# EAGLE design Lumazoid_v1.0 (EAGLE 6.4)
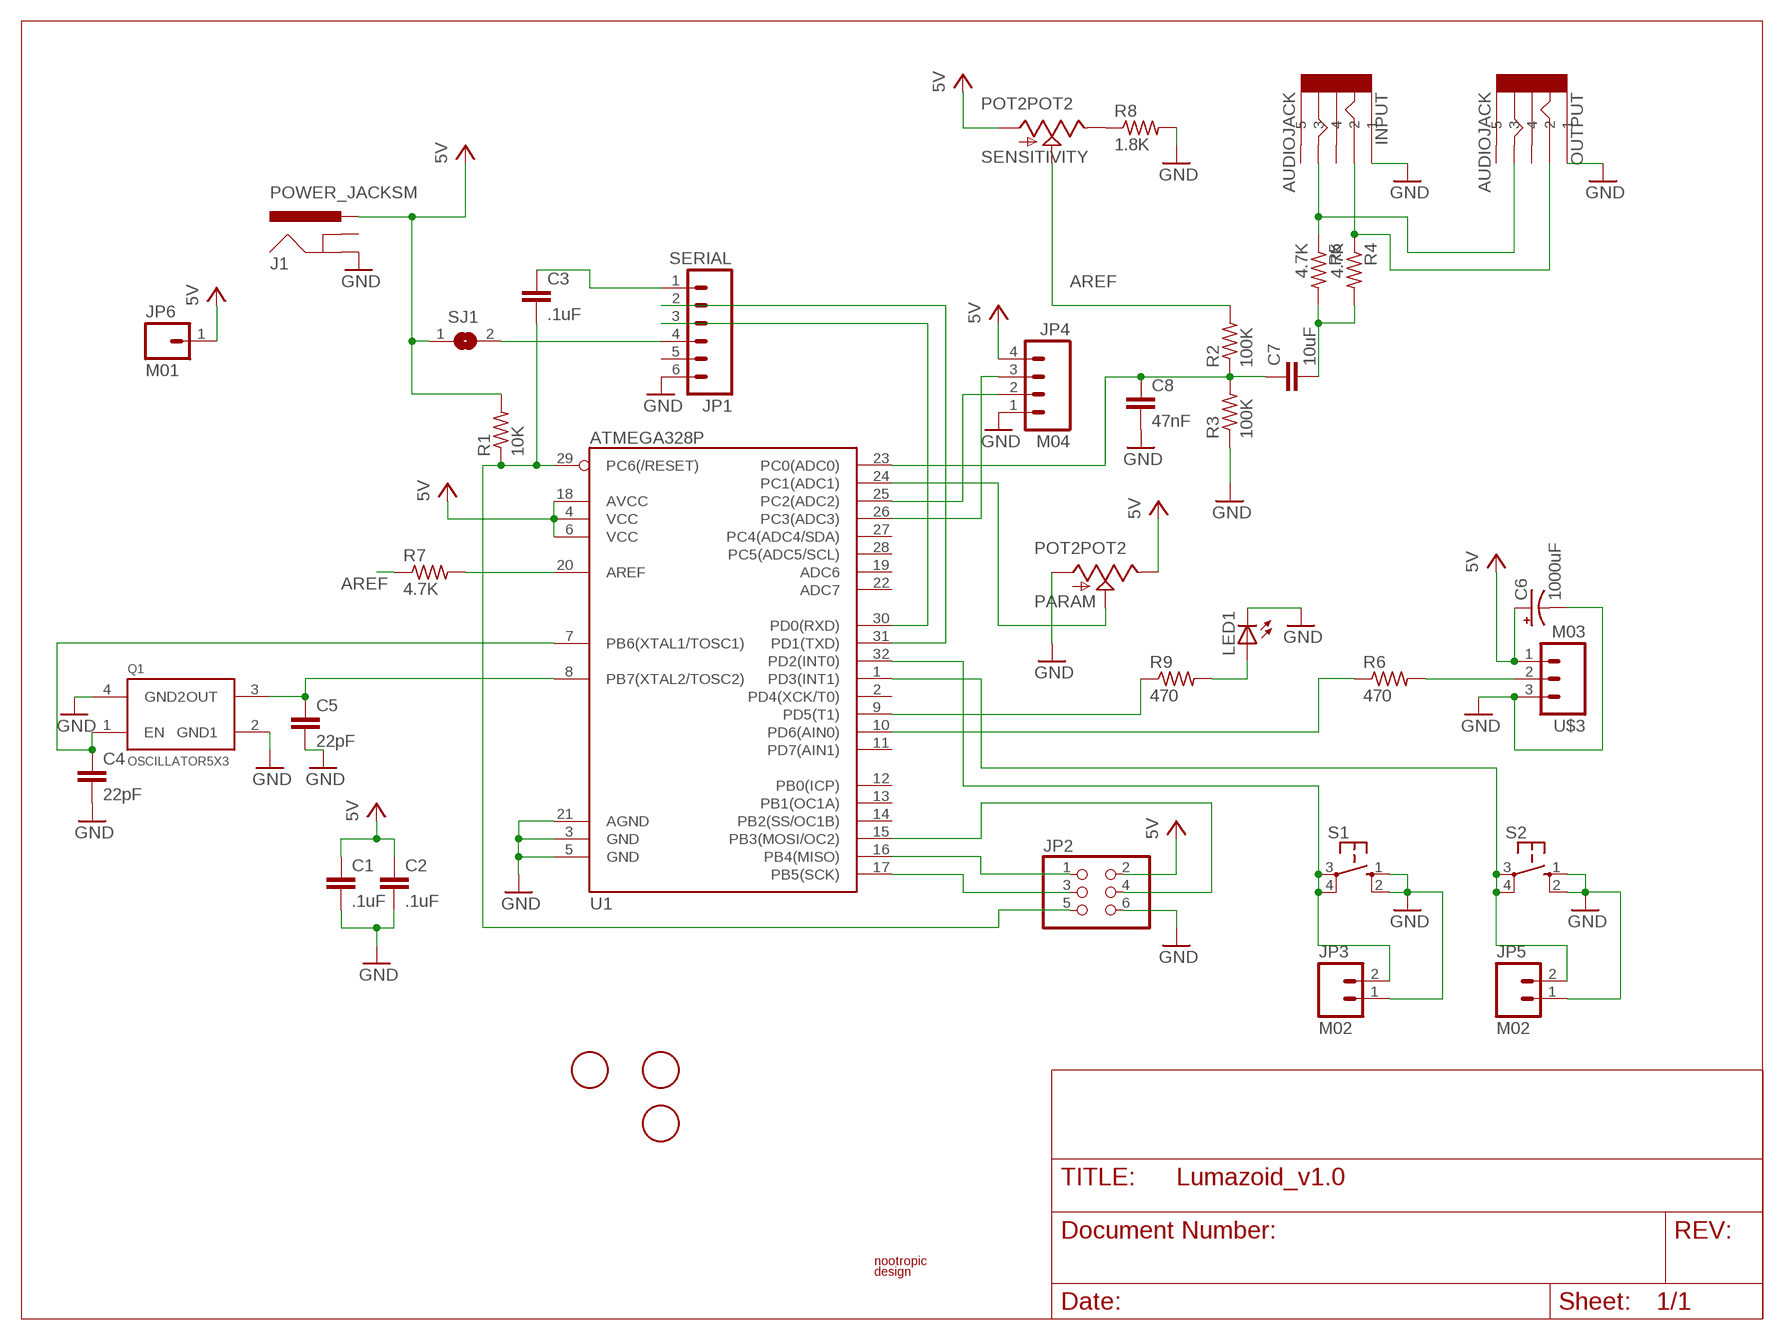
[diagram p0: schematic, sheet 1]

## Parts
C1  .1uF  CAPC0603  [C0603]
C2  .1uF  CAPC0603  [C0603]
C3  .1uF  CAPC0603  [C0603]
C4  22pF  CAPC0603  [C0603]
C5  22pF  CAPC0603  [C0603]
C6  1000uF  CPOL-USE5-10.5  [E5-10,5]
C7  10uF  CAPC1206  [C1206]
C8  47nF  CAPC0603  [C0603]
FID1  FIDUCIAL  [FIDUCIAL_1MM]
FID2  FIDUCIAL  [FIDUCIAL_1MM]
FID3  FIDUCIAL  [FIDUCIAL_1MM]
INPUT  AUDIOJACK  [AUDIOJACK]
J1  POWER_JACKSM  [POWER_JACK_SM]
JP1  SERIAL  M06  [1X06]
JP2  PINHD-2X3  [2X03]
JP3  M02  [1X02]
JP4  M04  [1X04]
JP5  M02  [1X02]
JP6  M01  [1X01]
LED1  LEDCHIPLED_0805  [CHIPLED_0805]
OUTPUT  AUDIOJACK  [AUDIOJACK]
PARAM  POT2POT2  [ALPS_POT]
Q1  OSCILLATOR5X3  [CRYSTAL-SMD-5X3]
R1  10K  R-USR0603  [R0603]
R2  100K  R-USR0603  [R0603]
R3  100K  R-USR0603  [R0603]
R4  4.7K  R-USR0603  [R0603]
R5  4.7K  R-USR0603  [R0603]
R6  470  R-USR0603  [R0603]
R7  4.7K  R-USR0603  [R0603]
R8  1.8K  R-USR0603  [R0603]
R9  470  R-USR0603  [R0603]
S1  SWITCH-TACT6MMSMT-J  [DTSM-6-JBEND]
S2  SWITCH-TACT6MMSMT-J  [DTSM-6-JBEND]
SENSITIVITY  POT2POT2  [ALPS_POT]
SJ1  SJ  [SJ]
U1  ATMEGA328P  ATMEGA328_SMT  [TQFP32-08]
U$1  LOGO  [LOGO_SMALL]
U$3  M03  [1X03]

## Nets
A0: C7.1 C8.1 R2.1 R3.2 U1.23(PC0(ADC0))
A1: PARAM.P$2 U1.24(PC1(ADC1))
A2: JP4.2 U1.25(PC2(ADC2))
A3: JP4.3 U1.26(PC3(ADC3))
AREF: R2.2 R7.1 SENSITIVITY.P$2
D1: JP5.2 S2.3(P) S2.4(P1) U1.1(PD3(INT1))
D2: JP3.2 S1.3(P) S1.4(P1) U1.32(PD2(INT0))
DTR: C3.1 JP1.1
GND: C1.2 C2.2 C4.2 C5.2 C6.- C8.2 INPUT.1 J1.GND JP1.6 JP2.6 JP3.1 JP4.1 JP5.1 LED1.C OUTPUT.1 PARAM.P$1 Q1.2(GND1) Q1.4(GND2) R3.1 R8.2 S1.1(S) S1.2(S1) S2.1(S) S2.2(S1) U1.3(GND) U1.5(GND) U1.21(AGND) U$3.3
MISO: JP2.1 U1.16(PB4(MISO))
MOSI: JP2.4 U1.15(PB3(MOSI/OC2))
N$1: R6.1 U1.10(PD6(AIN0))
N$2: R6.2 U$3.2
N$3: INPUT.2 OUTPUT.2 R4.1
N$4: C5.1 Q1.3(OUT) U1.8(PB7(XTAL2/TOSC2))
N$5: INPUT.3 OUTPUT.3 R5.1
N$6: C4.1 Q1.1(EN) U1.7(PB6(XTAL1/TOSC1))
N$7: R9.1 U1.9(PD5(T1))
N$8: LED1.A R9.2
N$11: JP1.4 SJ1.2
N$13: C7.2 R4.2 R5.2
N$14: R7.2 U1.20(AREF)
N$16: R8.1 SENSITIVITY.P$3
RESET: C3.2 JP2.5 R1.1 U1.29(PC6(/RESET))
RX: JP1.3 U1.30(PD0(RXD))
SCK: JP2.3 U1.17(PB5(SCK))
TX: JP1.2 U1.31(PD1(TXD))
VCC: C1.1 C2.1 C6.+ J1.PWR JP2.2 JP4.4 JP6.1 PARAM.P$3 R1.2 SENSITIVITY.P$1 SJ1.1 U1.4(VCC) U1.6(VCC) U1.18(AVCC) U$3.1 ; supply symbol labelled 5V
Unconnected: INPUT.4 INPUT.5 J1.GNDBREAK JP1.5 OUTPUT.4 OUTPUT.5 U1.2(PD4(XCK/T0)) U1.11(PD7(AIN1)) U1.12(PB0(ICP)) U1.13(PB1(OC1A)) U1.14(PB2(SS/OC1B)) U1.19(ADC6) U1.22(ADC7) U1.27(PC4(ADC4/SDA)) U1.28(PC5(ADC5/SCL))

## Library data of the parts
C1-C5 C7 C8 = nootropicdesign:CAP: Unpolarized capacitor
C6 = adafruit:CPOL-US: POLARIZED CAPACITOR, American symbol
FID1-FID3 = nootropicdesign:FIDUCIAL: For use by pick and place machines to calibrate the vision/machine, 1mm By microbuilder.eu
INPUT OUTPUT = nootropicdesign:AUDIOJACK
J1 = nootropicdesign:POWER_JACK: Power Jack This is the standard 5.5mm barrel jack for power. The PTH is the most common, proven, reliable, footprint. The Slot footprint only works if the mill layer is transmitted to the PCB fab house so be warned. Spark Fun Electronics SKU : PRT-00119 SMT: CONN-08106 Mating wall wart : TOL-00298 (and others)
JP1 = nootropicdesign:M06: 6-pin header
JP2 = nootropicdesign:PINHD-2X3: PIN HEADER
JP3 JP5 = nootropicdesign:M02: 2-pin header
JP4 = nootropicdesign:M04: 4-pin header
JP6 = nootropicdesign:M01: 2-pin header
LED1 = nootropicdesign:LED: LED OSRAM: - CHIPLED LG R971, LG N971, LY N971, LG Q971, LY Q971, LO R971, LY R971 LH N974, LH R974 LS Q976, LO Q976, LY Q976 LO Q996 - Hyper CHIPLED LW Q18S LB Q993, LB Q99A, LB R99A - SideLED LS A670, LO A670, LY A670, LG A670, LP A670 LB A673, LV A673, LT A673, LW A673 LH A674 LY A675 LS A676, LA A676, LO A676, LY A676, LW A676 LS A679, LY A679, LG A679 - Hyper Micro SIDELED® LS Y876, LA Y876, LO Y876, LY Y876 LT Y87S - SmartLED LW L88C, LW L88S LB L89C, LB L89S, LG L890 LS L89K, LO L89K, LY L89K LS L896, LA L896, LO L896, LY L896 - TOPLED LS T670, LO T670, LY T670, LG T670, LP T670 LSG T670, LSP T670, LSY T670, LOP T670, LYG T670 LG T671, LOG T671, LSG T671 LB T673, LV T673, LT T673, LW T673 LH T674 LS T676, LA T676, LO T676, LY T676, LB T676, LH T676, LSB T676, LW T676 LB T67C, LV T67C, LT T67C, LS T67K, LO T67K, LY T67K, LW E67C LS E67B, LA E67B, LO E67B, LY E67B, LB E67C, LV E67C, LT E67C LW T67C LS T679, LY T679, LG T679 LS T770, LO T770, LY T770, LG T770, LP T770 LB T773, LV T773, LT T773, LW T773 LH T774 LS E675, LA E675, LY E675, LS T675 LS T776, LA T776, LO T776, LY T776, LB T776 LHGB T686 LT T68C, LB T68C - Hyper Mini TOPLED® LB M676 - Mini TOPLED Santana® LG M470 LS M47K, LO M47K, LY M47K Source: http://www.osram.convergy.de/
PARAM SENSITIVITY = nootropicdesign:POT2
Q1 = nootropicdesign:OSCILLATOR: Generic 5x3 and 7x5 oscillators
R1-R9 = nootropicdesign:R-US: Resistor
S1 S2 = nootropicdesign:SWITCH-TACT: 12MM Tactile Switch
SJ1 = jumper:SJ: SMD solder JUMPER
U1 = SparkFun-DigitalIC:ATMEGA328_SMT: 32-Pin Atmega328 part Commonly used on Arduino compatible boards Available in QFP and QFN packages TQFP is IC-09069 QFN is non-stock; PROD_ID: IC-09069
U$1 = nootropicdesign:LOGO
U$3 = nootropicdesign:M03

## Board
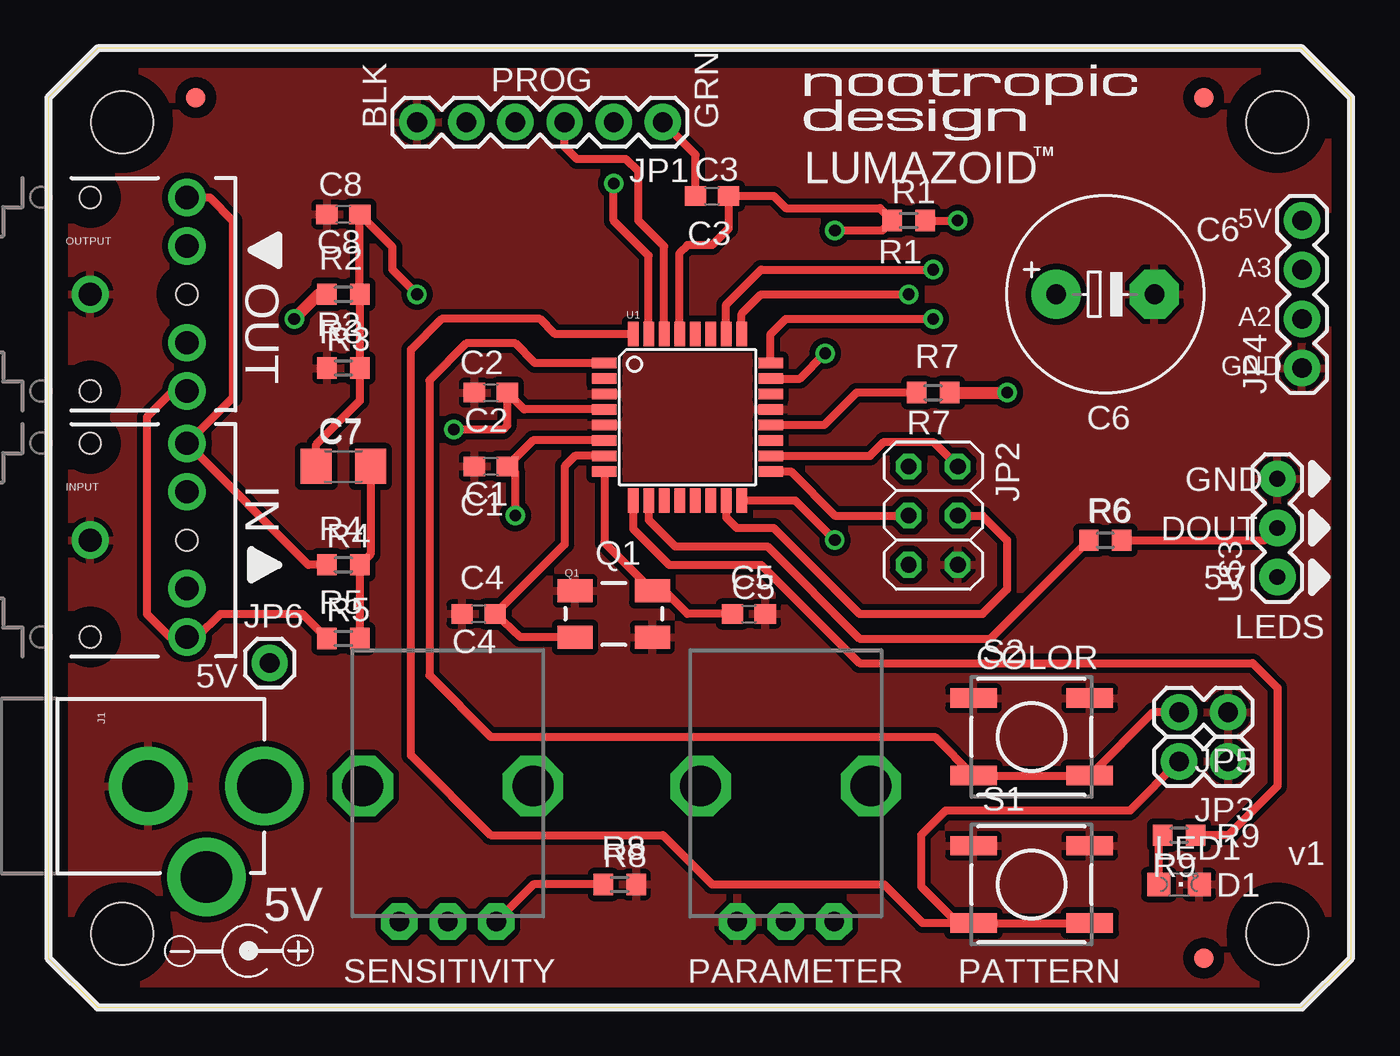
[diagram p1: board, top side]
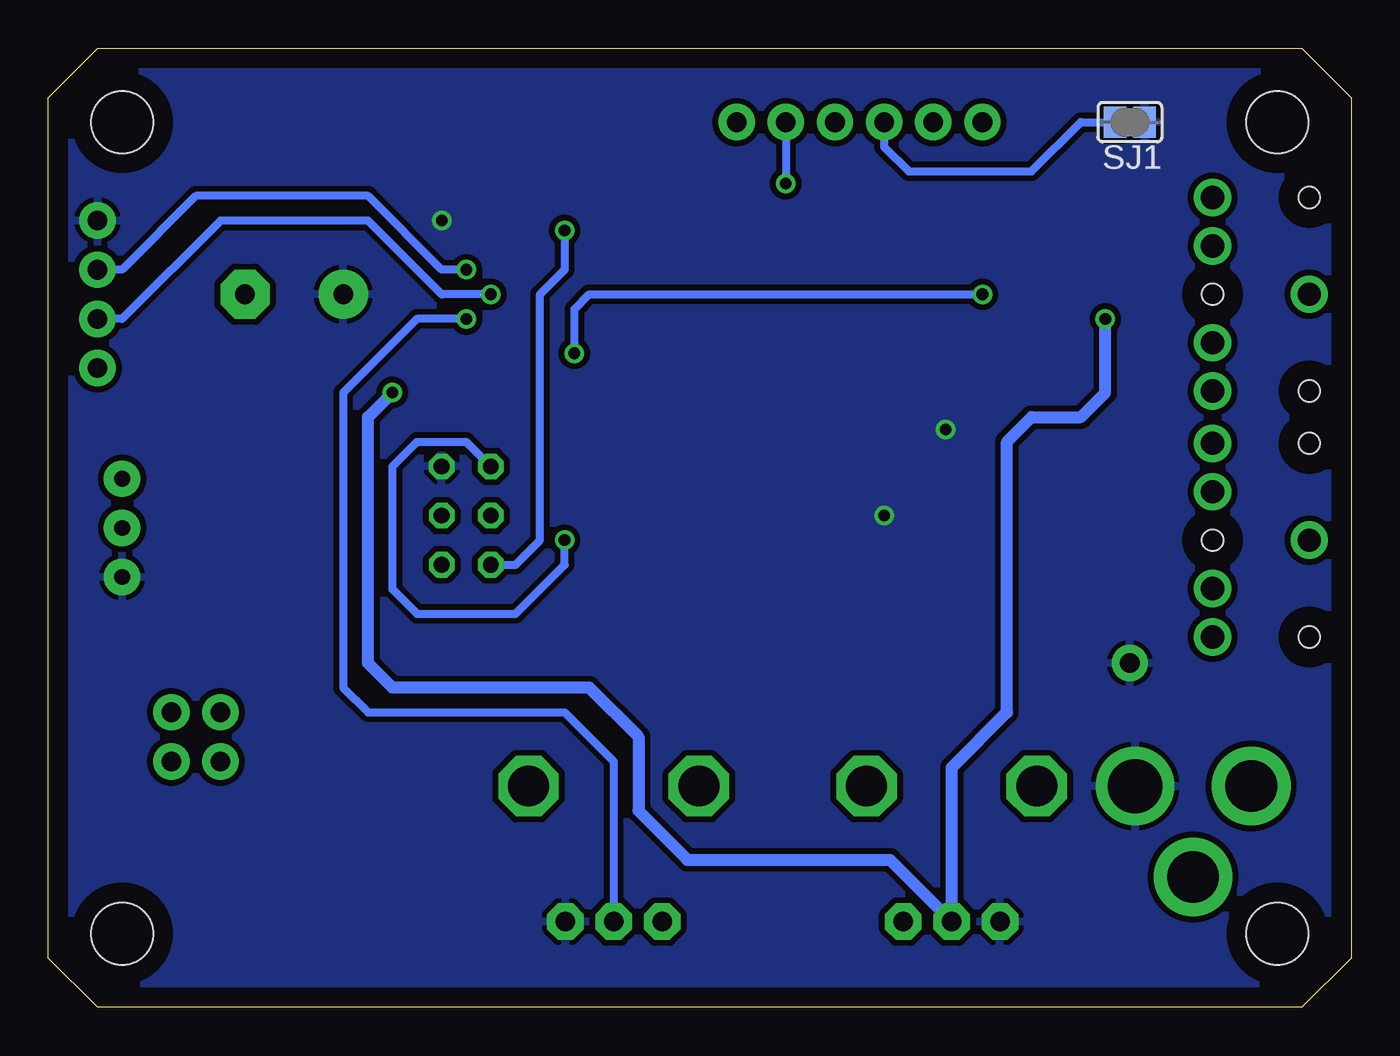
[diagram p2: board, bottom side, seen from below]

Size 67.31 x 49.53 mm. Coordinates in mm from the lower left corner, seen from the top.
Outline: 0,2.54 2.54,0 64.77,0 67.31,2.54 67.31,46.99 64.77,49.53 2.54,49.53 0,46.99 0,2.54
Copper layers (1*16): Top 0.035mm / dielectric 1.5mm / Bottom 0.035mm
Design rules "default *": minimum track width 10mil, minimum drill 20mil, track to track 12mil, track to pad 12mil, pad to pad 8mil, via to via 8mil, smd to smd 8mil, copper to edge 40mil, drill to drill 8mil, minimum pad ring 10mil, minimum via ring 8mil, stop-mask expansion 4mil, vias tented up to drill 25mil, thermal gap 10mil
Holes 3.2 mm at 3.81,3.81 3.81,45.72 63.5,3.81 63.5,45.72

### Footprints (pad centres in the part's own frame; a part is rotated, then mirrored left to right if it is on the bottom)
C0603 = smd 1.1 x 1: 1 -0.85,0; 2 0.85,0
E5-10,5 = drill 1.016 pad 2.54: + -2.54,0 | drill 1.016 pad 2.54 octagon: - 2.54,0
C1206 = smd 1.6 x 1.8: 1 -1.4,0; 2 1.4,0
FIDUCIAL_1MM = smd 1 x 1: 1 0,0
AUDIOJACK = drill 1.2 pad 1.93: 1 0,0; 2 5,5; 3 5,-5; 4 5,2.5; 5 5,-2.5 | hole 1.1: 0,5; 0,-5; 5,0
POWER_JACK_SM = drill 2.667 pad 4.064: GND 0,7.7; GNDBREAK 4.7,10.7 | drill 2.794 pad 4.064: PWR 0,13.7
1X06 = drill 1.016 pad 1.88: 1 0,0; 2 2.54,0; 3 5.08,0; 4 7.62,0; 5 10.16,0; 6 12.7,0
2X03 = drill 0.813 octagon: 1 -2.54,-1.27; 2 -2.54,1.27; 3 0,-1.27; 4 0,1.27; 5 2.54,-1.27; 6 2.54,1.27
1X02 = drill 1.016 pad 1.88: 1 0,0; 2 2.54,0
1X04 = drill 1.016 pad 1.88: 1 -3.81,0; 2 -1.27,0; 3 1.27,0; 4 3.81,0
1X01 = drill 1.016 pad 1.88: 1 0,0
CHIPLED_0805 = smd 1.2 x 1.2: A 0,-1.05; C 0,1.05
ALPS_POT = drill 1 pad 1.88 octagon: P$1 7,-2.5; P$2 7,0; P$3 7,2.5 | drill 2.108 octagon: P$4 0,-4.4; P$5 0,4.4
CRYSTAL-SMD-5X3 = smd 1.8 x 1.2: 1 -2,-1.2; 2 2,-1.2; 3 2,1.2; 4 -2,1.2
R0603 = smd 1 x 1.1: 1 -0.85,0; 2 0.85,0
DTSM-6-JBEND = smd 2.4 x 1: 1 -3,2; 2 3,2; 3 -3,-2; 4 3,-2
SJ = smd 1.168 x 1.6: 1 -0.762,0; 2 0.762,0
TQFP32-08 = smd 1.27 x 0.559: 1 -4.293,2.8; 2 -4.293,2; 3 -4.293,1.2; 4 -4.293,0.4; 5 -4.293,-0.4; 6 -4.293,-1.2; 7 -4.293,-2; 8 -4.293,-2.8; 17 4.293,-2.8; 18 4.293,-2; 19 4.293,-1.2; 20 4.293,-0.4; 21 4.293,0.4; 22 4.293,1.2; 23 4.293,2; 24 4.293,2.8 | smd 0.559 x 1.27: 9 -2.8,-4.293; 10 -2,-4.293; 11 -1.2,-4.293; 12 -0.4,-4.293; 13 0.4,-4.293; 14 1.2,-4.293; 15 2,-4.293; 16 2.8,-4.293; 25 2.8,4.293; 26 2,4.293; 27 1.2,4.293; 28 0.4,4.293; 29 -0.4,4.293; 30 -1.2,4.293; 31 -2,4.293; 32 -2.8,4.293
1X03 = drill 0.813 pad 1.88: 1 -2.54,0; 2 0,0; 3 2.54,0

### Placement (x,y rotation side)
C1  22.86,27.94 180 top
C2  22.86,31.75 180 top
C3  34.29,41.91 0 top
C4  22.23,20.32 180 top
C5  36.2,20.32 0 top
C6  54.61,36.83 0 top
C7  15.24,27.94 0 top
C8  15.24,40.96 180 top
FID1  7.62,46.99 0 top
FID2  59.69,46.99 0 top
FID3  59.69,2.54 0 top
INPUT  2.16,24.13 0 top
J1  -2.54,11.43 270 top
JP1  31.75,45.72 180 top
JP2  45.72,25.4 270 top
JP3  60.96,12.7 180 top
JP4  64.77,36.83 90 top
JP5  60.96,15.24 180 top
JP6  11.43,17.78 0 top
LED1  58.42,6.35 270 top
OUTPUT  2.16,36.83 0 top
PARAM  38.1,11.43 270 top
Q1  29.21,20.32 0 top
R1  44.45,40.64 0 top
R2  15.24,36.83 180 top
R3  15.24,33.02 0 top
R4  15.24,22.86 0 top
R5  15.24,19.05 0 top
R6  54.61,24.13 0 top
R7  45.72,31.75 180 top
R8  29.53,6.35 0 top
R9  58.42,8.89 180 top
S1  50.8,6.35 0 top
S2  50.8,13.97 0 top
SENSITIVITY  20.64,11.43 270 top
SJ1  11.43,45.72 180 bottom
U1  33.02,30.48 0 top
U$1  39.05,44.77 0 top
U$3  63.5,24.77 90 top

### Tracks (layer width: path | path; a pad name or v marks a point on that pad's centre or on a via)
A0  (via drill 0.6)
  Top 0.406: U1.23 38.83,32.48 v40.13,33.78 | C7.1 13.84,29.08 16.09,31.33 R3.2 R2.1 C8.1 17.78,39.27 17.78,38.1 v19.05,36.83
  Bottom 0.406: v40.13,33.78 40.13,36.07 39.37,36.83 v19.05,36.83
A1  (via drill 0.6)
  Top 0.406: U1.24 37.31,34.77 38.1,35.56 v45.72,35.56
  Bottom 0.406: PARAM.P$2 38.1,12.7 40.64,15.24 50.8,15.24 52.07,16.51 52.07,31.75 48.26,35.56 v45.72,35.56
A2  (via drill 0.6)
  Top 0.406: U1.25 35.82,35.82 36.83,36.83 v44.45,36.83
  Bottom 0.406: v44.45,36.83 46.99,36.83 50.8,40.64 58.42,40.64 63.5,35.56 JP4.2
A3  (via drill 0.6)
  Top 0.406: U1.26 35.02,36.29 36.83,38.1 v45.72,38.1
  Bottom 0.406: v45.72,38.1 46.99,38.1 50.8,41.91 59.69,41.91 63.5,38.1 JP4.3
AREF  (via drill 0.6)
  Top 0.61: R7.1 v49.53,31.75 | R2.2 13.97,36.83 v12.7,35.56
  Bottom 0.61: v49.53,31.75 50.8,30.48 50.8,17.78 49.53,16.51 39.37,16.51 36.83,13.97 36.83,10.16 34.29,7.62 23.83,7.62 SENSITIVITY.P$2 20.64,12.38 17.78,15.24 17.78,29.21 16.51,30.48 13.97,30.48 12.7,31.75 v12.7,35.56
D1
  Top 0.406: U1.1 25.14,33.28 24.13,34.29 21.59,34.29 19.68,32.38 19.68,17.14 22.86,13.97 45.8,13.97 S2.3 S2.4 57.07,15.24 JP5.2
D2
  Top 0.406: S1.4 S1.3 46.99,4.35 | U1.32 26.19,34.77 25.4,35.56 20.32,35.56 18.73,33.97 18.73,13.02 22.86,8.89 31.75,8.89 34.29,6.35 43.18,6.35 45.18,4.35 46.99,4.35 | JP3.2 55.88,10.16 46.35,10.16 45.09,8.89 45.09,6.25 46.99,4.35
DTR
  Top 0.406: C3.1 33.44,44.03 JP1.1
GND
  pour Top: 0.64,46.67 2.86,48.9 64.45,48.9 66.67,46.67 66.67,2.86 64.45,0.64 2.86,0.64 0.64,2.86
MISO  (via drill 0.6)
  Top 0.406: U1.16 38.58,26.19 v40.64,24.13
  Bottom 0.406: JP2.1 45.72,29.21 48.26,29.21 49.53,27.94 49.53,21.59 48.26,20.32 43.18,20.32 40.64,22.86 v40.64,24.13
MOSI
  Top 0.406: JP2.4 48.26,25.4 49.53,24.13 49.53,21.59 48.26,20.32 41.91,20.32 37.47,24.77 35.56,24.77 35.02,25.3 U1.15
N$1
  Top 0.406: U1.10 31.02,25.18 32.38,23.81 37.15,23.81 41.91,19.05 48.68,19.05 R6.1
N$2
  Top 0.406: R6.2 62.87,24.13 U$3.2
N$3
  Top 0.406: OUTPUT.2 8.34,41.83 9.53,40.64 9.53,31.5 INPUT.2 13.43,22.86 R4.1
N$4
  Top 0.406: U1.8 28.73,24 Q1.3 31.28,21.59 31.75,21.59 33.02,20.32 C5.1
N$5
  Top 0.406: OUTPUT.3 6.43,31.83 5.08,30.48 5.08,20.32 6.27,19.13 INPUT.3 7.7,19.13 8.89,20.32 13.12,20.32 R5.1
N$6
  Top 0.406: Q1.1 24.38,19.12 C4.1 26.67,23.91 26.67,27.94 27.21,28.48 U1.7
N$7
  Top 0.406: U1.9 30.22,24.71 32.07,22.86 36.83,22.86 41.91,17.78 62.23,17.78 63.5,16.51 63.5,11.43 60.96,8.89 R9.1
N$8
  Top 0.406: LED1.A 57.37,8.69 R9.2
N$11
  Bottom 0.406: JP1.4 24.13,44.45 22.86,43.18 16.51,43.18 13.97,45.72 SJ1.2
N$13
  Top 0.406: R5.2 R4.2 16.64,23.41 C7.2
N$14
  Top 0.406: U1.20 40.09,30.08 41.76,31.75 R7.2
N$16
  Top 0.406: R8.1 25.06,6.35 SENSITIVITY.P$3
RESET  (via drill 0.6)
  Top 0.406: U1.29 32.62,38.97 33.02,39.37 34.29,39.37 35.14,40.22 C3.2 37.47,41.91 38.1,41.27 42.97,41.27 R1.1 43.09,40.13 v40.64,40.13
  Bottom 0.406: JP2.5 43.18,22.86 41.91,24.13 41.91,36.83 40.64,38.1 v40.64,40.13
RX
  Top 0.406: U1.30 31.82,39.3 30.48,40.64 30.48,43.18 29.84,43.81 27.3,43.81 26.67,44.45 JP1.3
SCK
  Top 0.406: U1.17 38.36,27.68 40.64,25.4 JP2.3
TX  (via drill 0.6)
  Top 0.406: U1.31 31.02,38.83 29.21,40.64 v29.21,42.55
  Bottom 0.406: JP1.2 v29.21,42.55
VCC  (via drill 0.6)
  Top 0.406: R1.2 v46.99,40.64 | v24.13,25.4 24.13,27.62 C1.1 25.05,29.28 U1.6 | U1.18 42.45,28.48 43.18,29.21 45.72,29.21 JP2.2 | U1.4 24.58,30.88 C2.1 23.71,30.06 23.5,29.84 v20.95,29.84
  pour Bottom: 0.64,46.67 2.86,48.9 64.45,48.9 66.67,46.67 66.67,2.86 64.45,0.64 2.86,0.64 0.64,2.86

### Text on the board
tPlace: PROG | BLK | GRN | TM | LUMAZOID | C8 | 5V | C3 | R2 | R1 | A3 | OUT | A2 | R3 | C2 | R7 | GND | C6 | C7 | IN | GND | C1 | R6 | R4 | DOUT | Q1 | C4 | C5 | 5V | R5 | LEDS | 5V | COLOR | R8 | R9 | v1 | D1 | 5V | SENSITIVITY | PARAMETER | PATTERN